# EAGLE schematic FT232_BreakOutBoard_rev2 (EAGLE 8.4.0)
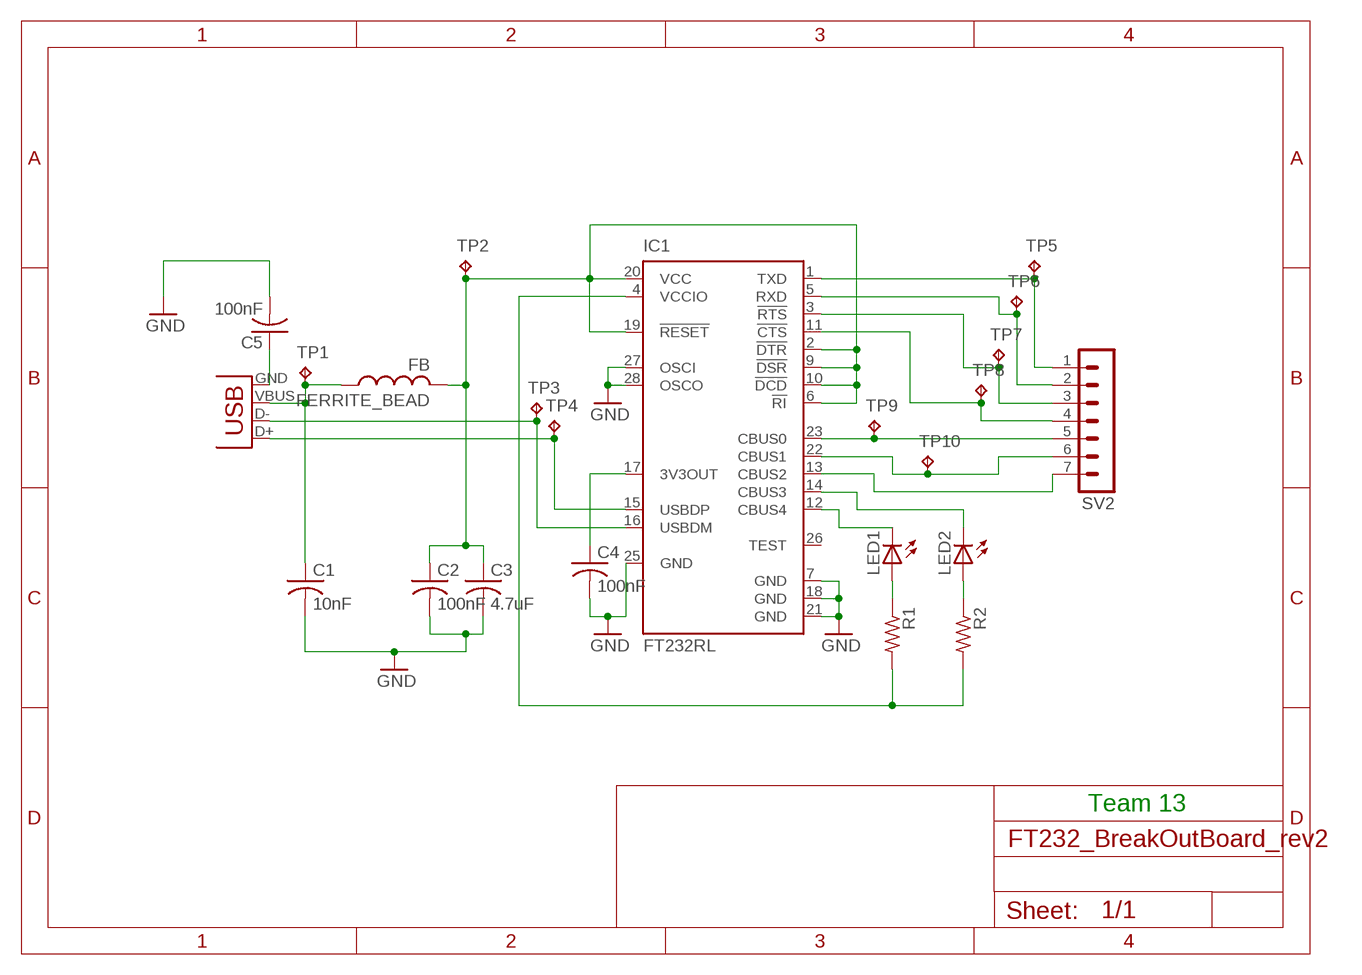
[diagram p0: schematic, sheet 1]

## Parts
C1  10nF  C-USC0805  [C0805]
C2  100nF  C-USC0805  [C0805]
C3  4.7uF  C-USC0805  [C0805]
C4  100nF  C-USC0805  [C0805]
C5  100nF  C-USC0805  [C0805]
FERRITE_BEAD  FB  [FB]
IC1  FT232RL  [SSOP28]
LED1  LEDCHIPLED_0805  [CHIPLED_0805]
LED2  LEDCHIPLED_0805  [CHIPLED_0805]
R1  R-US_R0805  [R0805]
R2  R-US_R0805  [R0805]
SV2  MA07-1  [MA07-1]
TP1  TPB1,27  [B1,27]
TP2  TPB1,27  [B1,27]
TP3  TPB1,27  [B1,27]
TP4  TPB1,27  [B1,27]
TP5  TPB1,27  [B1,27]
TP6  TPB1,27  [B1,27]
TP7  TPB1,27  [B1,27]
TP8  TPB1,27  [B1,27]
TP9  TPB1,27  [B1,27]
TP10  TPB1,27  [B1,27]
X1  USB-B-H  [USB-B-H]

## Nets
DELEETE: IC1.4(VCCIO) R1.2 R2.2
GND: C1.2 C2.2 C3.2 C4.2 C5.2 IC1.7(GND) IC1.18(GND) IC1.21(GND) IC1.25(GND) IC1.27(OSCI) IC1.28(OSCO)
N$1: C5.1 X1.GND
N$2: C4.1 IC1.17(3V3OUT)
N$3: IC1.15(USBDP) TP4.TP X1.D+
N$5: IC1.16(USBDM) TP3.TP X1.D-
N$6: IC1.1(TXD) SV2.1 TP5.TP
N$7: C1.1 FERRITE_BEAD.P$1 TP1.TP X1.VBUS
N$8: IC1.5(RXD) SV2.2 TP6.TP
N$9: IC1.3(!RTS) SV2.3 TP7.TP
N$10: IC1.11(!CTS) SV2.4 TP8.TP
N$11: IC1.23(CBUS0) SV2.5 TP9.TP
N$12: LED2.A R2.1
N$13: LED1.A R1.1
N$14: IC1.22(CBUS1) SV2.6 TP10.TP
N$15: IC1.12(CBUS4) LED1.C
N$16: IC1.14(CBUS3) LED2.C
N$17: C2.1 C3.1 FERRITE_BEAD.P$2 IC1.2(!DTR) IC1.6(!RI) IC1.9(!DSR) IC1.10(!DCD) IC1.19(!RESET) IC1.20(VCC) TP2.TP
N$18: IC1.13(CBUS2) SV2.7
Unconnected: IC1.26(TEST)

## Notes on the sheet
- Team 13

## Library data of the parts
C1-C5 = adafruit:C-US: CAPACITOR, American symbol
FERRITE_BEAD = adafruit:FB: Ferrite bead Digikey #P9821BK-ND
IC1 = ftdichip:FT232R: Source: http://www.ftdichip.com/Documents/DataSheets/DS_FT232R_v104.pdf; MPN: FT232RL; OC_FARNELL: 1146032; OC_NEWARK: 91K9918
LED1 LED2 = adafruit:LED: LED OSRAM: - CHIPLED LG R971, LG N971, LY N971, LG Q971, LY Q971, LO R971, LY R971 LH N974, LH R974 LS Q976, LO Q976, LY Q976 LO Q996 - Hyper CHIPLED LW Q18S LB Q993, LB Q99A, LB R99A - SideLED LS A670, LO A670, LY A670, LG A670, LP A670 LB A673, LV A673, LT A673, LW A673 LH A674 LY A675 LS A676, LA A676, LO A676, LY A676, LW A676 LS A679, LY A679, LG A679 - Hyper Micro SIDELED® LS Y876, LA Y876, LO Y876, LY Y876 LT Y87S - SmartLED LW L88C, LW L88S LB L89C, LB L89S, LG L890 LS L89K, LO L89K, LY L89K LS L896, LA L896, LO L896, LY L896 - TOPLED LS T670, LO T670, LY T670, LG T670, LP T670 LSG T670, LSP T670, LSY T670, LOP T670, LYG T670 LG T671, LOG T671, LSG T671 LB T673, LV T673, LT T673, LW T673 LH T674 LS T676, LA T676, LO T676, LY T676, LB T676, LH T676, LSB T676, LW T676 LB T67C, LV T67C, LT T67C, LS T67K, LO T67K, LY T67K, LW E67C LS E67B, LA E67B, LO E67B, LY E67B, LB E67C, LV E67C, LT E67C LW T67C LS T679, LY T679, LG T679 LS T770, LO T770, LY T770, LG T770, LP T770 LB T773, LV T773, LT T773, LW T773 LH T774 LS E675, LA E675, LY E675, LS T675 LS T776, LA T776, LO T776, LY T776, LB T776 LHGB T686 LT T68C, LB T68C - Hyper Mini TOPLED® LB M676 - Mini TOPLED Santana® LG M470 LS M47K, LO M47K, LY M47K Source: http://www.osram.convergy.de/
R1 R2 = adafruit:R-US_: RESISTOR, American symbol
SV2 = con-lstb:MA07-1: PIN HEADER; OC_FARNELL: unknown; OC_NEWARK: unknown
TP1-TP10 = testpad:TP: Test pad
X1 = con-usb:USB: USB Connectors